# Altium project PCB_STM32_PULT.PrjPcb
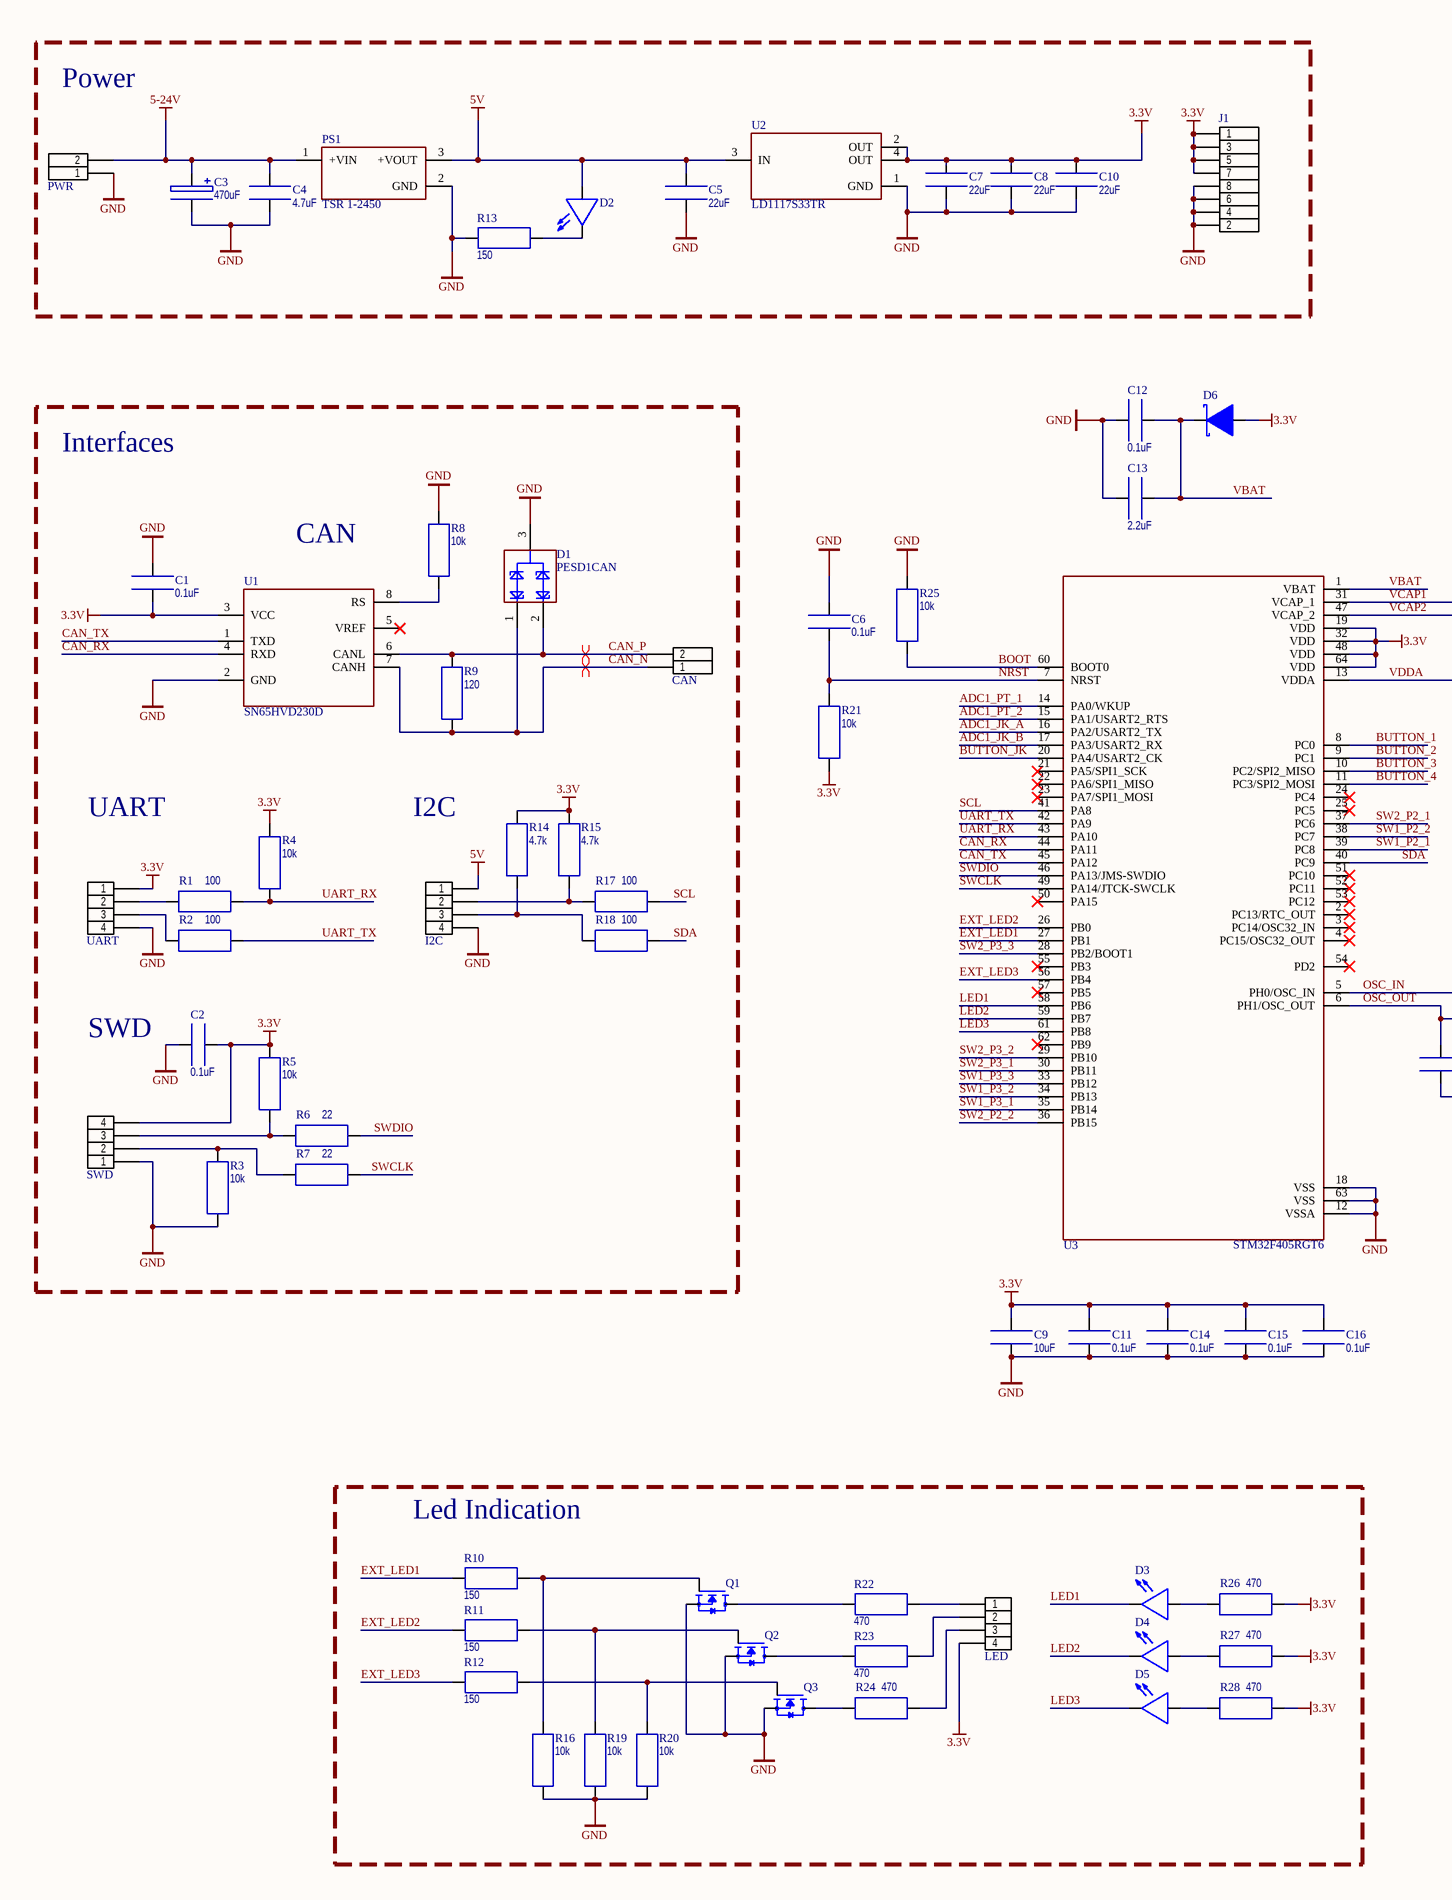
[diagram p0: Sheet1.SchDoc, left]
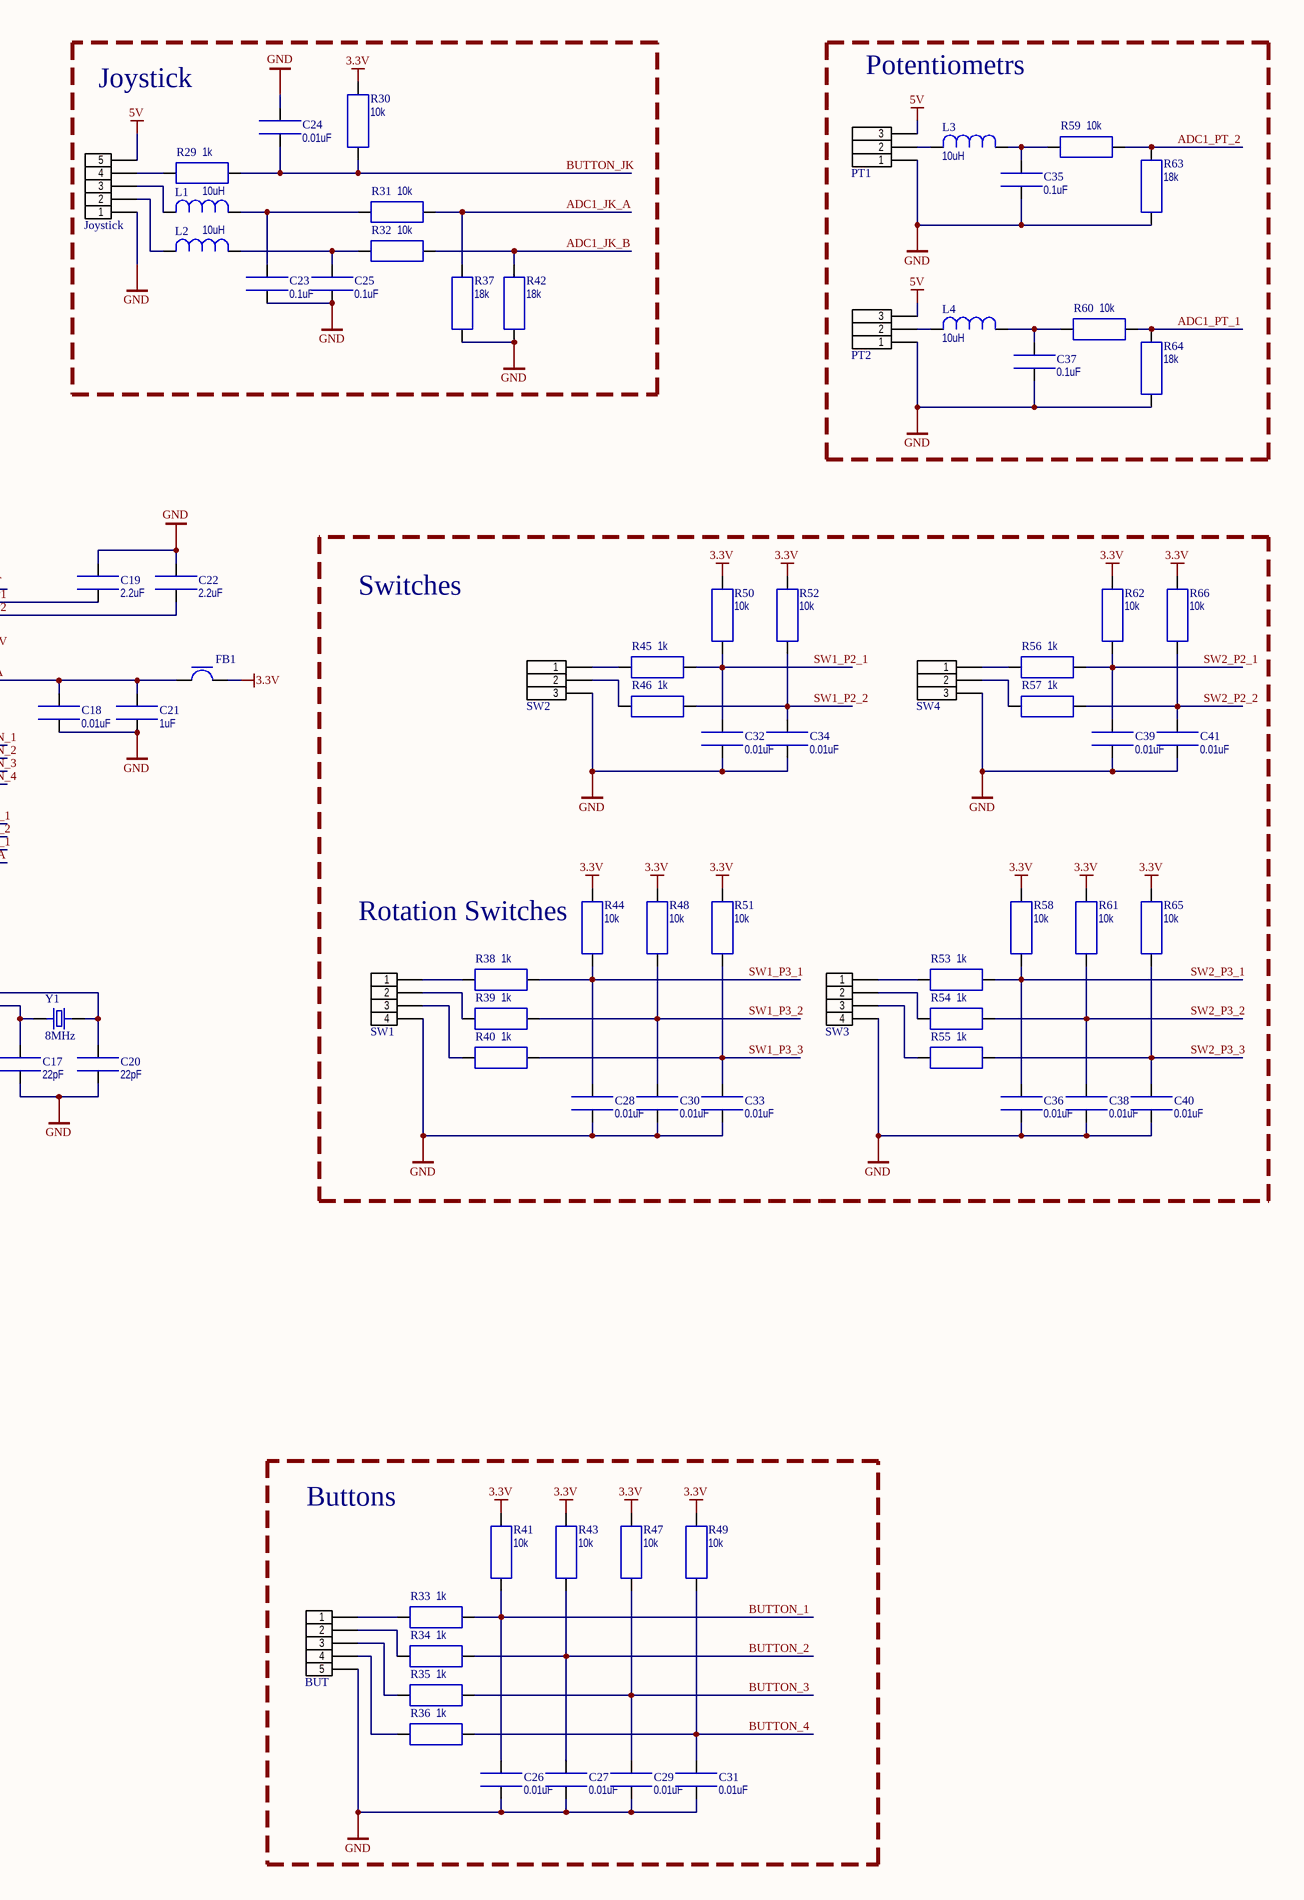
[diagram p1: Sheet1.SchDoc, right]
1 sheet, 141 parts. Net scope: global (net labels, ports and power ports of the same name join across sheets).
Board file: PCB1.PcbDoc

## Sheet Sheet1.SchDoc
size A2; SheetNumber: 1; SheetTotal: 1

### Parts
BUT  B5B-XH-A  [JST_B5B-XH-A]  (value not drawn)
C1  0.1uF  [CAP 0603]
C2  0.1uF  [CAP 0603]
C3  470uF  [ECAP G]
C4  4.7uF  [CAP 0603]
C5  22uF  [CAP 0805]
C6  0.1uF  [CAP 0603]
C7  22uF  [CAP 0805]
C8  22uF  [CAP 0805]
C9  10uF  [CAP 0805]
C10  22uF  [CAP 0805]
C11  0.1uF  [CAP 0603]
C12  0.1uF  [CAP 0603]
C13  2.2uF  [CAP 0603]
C14  0.1uF  [CAP 0603]
C15  0.1uF  [CAP 0603]
C16  0.1uF  [CAP 0603]
C17  22pF  [CAP 0603]
C18  0.01uF  [CAP 0603]
C19  2.2uF  [CAP 0603]
C20  22pF  [CAP 0603]
C21  1uF  [CAP 0603]
C22  2.2uF  [CAP 0603]
C23  0.1uF  [CAP 0603]
C24  0.01uF  [CAP 0603]
C25  0.1uF  [CAP 0603]
C26  0.01uF  [CAP 0603]
C27  0.01uF  [CAP 0603]
C28  0.01uF  [CAP 0603]
C29  0.01uF  [CAP 0603]
C30  0.01uF  [CAP 0603]
C31  0.01uF  [CAP 0603]
C32  0.01uF  [CAP 0603]
C33  0.01uF  [CAP 0603]
C34  0.01uF  [CAP 0603]
C35  0.1uF  [CAP 0603]
C36  0.01uF  [CAP 0603]
C37  0.1uF  [CAP 0603]
C38  0.01uF  [CAP 0603]
C39  0.01uF  [CAP 0603]
C40  0.01uF  [CAP 0603]
C41  0.01uF  [CAP 0603]
CAN  B2B-XH-A  [JST_B2B-XH-A]  (value not drawn)
D1  PESD1CAN  [SOT23-3]
D2  LED 0603  [LED 0603]  (value not drawn)
D3  LED 0603  [LED 0603]  (value not drawn)
D4  LED 0603  [LED 0603]  (value not drawn)
D5  LED 0603  [LED 0603]  (value not drawn)
D6  SM5819PL  [SOD-123FL]  (value not drawn)
FB1  Ferrite bead 0603  [Ferrite bead 0603]  (value not drawn)
I2C  B4B-XH-A  [JST_B4B-XH-A]  (value not drawn)
J1  Pin Header 2x4  [Pin Header 2x4]  (value not drawn)
Joystick  B5B-XH-A  [JST_B5B-XH-A]  (value not drawn)
L1  10uH  [L 0603]
L2  10uH  [L 0603]
L3  10uH  [L 0603]
L4  10uH  [L 0603]
LED  B4B-XH-A  [JST_B4B-XH-A]  (value not drawn)
PS1  TSR 1-2450  [SIP3]
PT1  B3B-XH-A  [JST_B3B-XH-A]  (value not drawn)
PT2  B3B-XH-A  [JST_B3B-XH-A]  (value not drawn)
PWR  B2B-XH-A  [JST_B2B-XH-A]  (value not drawn)
Q1  MMFTN20  [SOT23-3]  (value not drawn)
Q2  MMFTN20  [SOT23-3]  (value not drawn)
Q3  MMFTN20  [SOT23-3]  (value not drawn)
R1  100  [RES 0603]
R2  100  [RES 0603]
R3  10k  [RES 0603]
R4  10k  [RES 0603]
R5  10k  [RES 0603]
R6  22  [RES 0603]
R7  22  [RES 0603]
R8  10k  [RES 0603]
R9  120  [RES 0603]
R10  150  [RES 0603]
R11  150  [RES 0603]
R12  150  [RES 0603]
R13  150  [RES 0603]
R14  4.7k  [RES 0603]
R15  4.7k  [RES 0603]
R16  10k  [RES 0603]
R17  100  [RES 0603]
R18  100  [RES 0603]
R19  10k  [RES 0603]
R20  10k  [RES 0603]
R21  10k  [RES 0603]
R22  470  [RES 0603]
R23  470  [RES 0603]
R24  470  [RES 0603]
R25  10k  [RES 0603]
R26  470  [RES 0603]
R27  470  [RES 0603]
R28  470  [RES 0603]
R29  1k  [RES 0603]
R30  10k  [RES 0603]
R31  10k  [RES 0603]
R32  10k  [RES 0603]
R33  1k  [RES 0603]
R34  1k  [RES 0603]
R35  1k  [RES 0603]
R36  1k  [RES 0603]
R37  18k  [RES 0603]
R38  1k  [RES 0603]
R39  1k  [RES 0603]
R40  1k  [RES 0603]
R41  10k  [RES 0603]
R42  18k  [RES 0603]
R43  10k  [RES 0603]
R44  10k  [RES 0603]
R45  1k  [RES 0603]
R46  1k  [RES 0603]
R47  10k  [RES 0603]
R48  10k  [RES 0603]
R49  10k  [RES 0603]
R50  10k  [RES 0603]
R51  10k  [RES 0603]
R52  10k  [RES 0603]
R53  1k  [RES 0603]
R54  1k  [RES 0603]
R55  1k  [RES 0603]
R56  1k  [RES 0603]
R57  1k  [RES 0603]
R58  10k  [RES 0603]
R59  10k  [RES 0603]
R60  10k  [RES 0603]
R61  10k  [RES 0603]
R62  10k  [RES 0603]
R63  18k  [RES 0603]
R64  18k  [RES 0603]
R65  10k  [RES 0603]
R66  10k  [RES 0603]
SW1  B4B-XH-A  [JST_B4B-XH-A]  (value not drawn)
SW2  B3B-XH-A  [JST_B3B-XH-A]  (value not drawn)
SW3  B4B-XH-A  [JST_B4B-XH-A]  (value not drawn)
SW4  B3B-XH-A  [JST_B3B-XH-A]  (value not drawn)
SWD  B4B-XH-A  [JST_B4B-XH-A]  (value not drawn)
U1  SN65HVD230D  [SOIC8]
U2  LD1117S33TR  [SOT223]
U3  STM32F405RGT6  [LQFP64]
UART  B4B-XH-A  [JST_B4B-XH-A]  (value not drawn)
Y1  8MHz  [HC-49S]

### Blocks framed on the sheet
Power: C3-C5 C7 C8 C10 D2 J1 PS1 PWR R13 U2
Joystick: C23-C25 Joystick L1 L2 R29-R32 R37 R42
Potentiometrs: C35 C37 L3 L4 PT1 PT2 R59 R60 R63 R64
Led Indication: D3-D5 LED Q1-Q3 R10-R12 R16 R19 R20 R22-R24 R26-R28
Buttons: BUT C26 C27 C29 C31 R33-R36 R41 R43 R47 R49

### Nets
3.3V: C1.1 C2.2 C7.2 C8.2 C9.1 C10.2 C11.1 C14.1 C15.1 C16.1 D6.1 FB1.2 J1.1 J1.3 J1.5 J1.7 LED.4 R4.2 R5.2 R14.2 R15.2 R21.1 R26.2 R27.2 R28.2 R30.2 R41.2 R43.2 R44.2 R47.2 R48.2 R49.2 R50.2 R51.2 R52.2 R58.2 R61.2 R62.2 R65.2 R66.2 SWD.4 U1.3(VCC) U2.2(OUT) U2.4(OUT) U3.19(VDD) U3.32(VDD) U3.48(VDD) U3.64(VDD) UART.1
5-24V: C3.1 C4.2 PS1.1(+VIN) PWR.2
5V: C5.2 D2.1 I2C.1 Joystick.5 PS1.3(+VOUT) PT1.3 PT2.3 U2.3(IN)
GND: BUT.5 C1.2 C2.1 C3.2 C4.1 C5.1 C6.2 C7.1 C8.1 C9.2 C10.1 C11.2 C12.1 C13.2 C14.2 C15.2 C16.2 C17.1 C18.1 C19.2 C20.1 C21.1 C22.2 C23.1 C24.2 C25.1 C26.1 C27.1 C28.1 C29.1 C30.1 C31.1 C32.1 C33.1 C34.1 C35.1 C36.1 C37.1 C38.1 C39.1 C40.1 C41.1 D1.3 I2C.4 J1.2 J1.4 J1.6 J1.8 Joystick.1 PS1.2(GND) PT1.1 PT2.1 PWR.1 Q1.2(S) Q2.2(S) Q3.2(S) R3.1 R8.2 R13.1 R16.1 R19.1 R20.1 R25.2 R37.1 R42.1 R63.1 R64.1 SW1.4 SW2.3 SW3.4 SW4.3 SWD.1 U1.2(GND) U2.1(GND) U3.12(VSSA) U3.18(VSS) U3.63(VSS) UART.4
ADC1_JK_A: R31.2 R37.2 U3.16(PA2/USART2_TX)
ADC1_JK_B: R32.2 R42.2 U3.17(PA3/USART2_RX)
ADC1_PT_1: R60.2 R64.2 U3.14(PA0/WKUP)
ADC1_PT_2: R59.2 R63.2 U3.15(PA1/USART2_RTS)
BOOT: R25.1 U3.60(BOOT0)
BUTTON_1: C26.2 R33.2 R41.1 U3.8(PC0)
BUTTON_2: C27.2 R34.2 R43.1 U3.9(PC1)
BUTTON_3: C29.2 R35.2 R47.1 U3.10(PC2/SPI2_MISO)
BUTTON_4: C31.2 R36.2 R49.1 U3.11(PC3/SPI2_MOSI)
BUTTON_JK: C24.1 R29.2 R30.1 U3.20(PA4/USART2_CK)
CAN_N: CAN.1 D1.1 R9.1 U1.7(CANH)
CAN_P: CAN.2 D1.2 R9.2 U1.6(CANL)
CAN_RX: U1.4(RXD) U3.44(PA11)
CAN_TX: U1.1(TXD) U3.45(PA12)
EXT_LED1: R10.2 U3.27(PB1)
EXT_LED2: R11.2 U3.26(PB0)
EXT_LED3: R12.2 U3.56(PB4)
LED1: D3.2 U3.58(PB6)
LED2: D4.2 U3.59(PB7)
LED3: D5.2 U3.61(PB8)
NRST: C6.1 R21.2 U3.7(NRST)
OSC_IN: C20.2 U3.5(PH0/OSC_IN) Y1.2
OSC_OUT: C17.2 U3.6(PH1/OSC_OUT) Y1.1
SCL: R17.2 U3.41(PA8)
SDA: R18.2 U3.40(PC9)
SW1_P2_1: C32.2 R45.2 R50.1 U3.39(PC8)
SW1_P2_2: C34.2 R46.2 R52.1 U3.38(PC7)
SW1_P3_1: C28.2 R38.2 R44.1 U3.35(PB14)
SW1_P3_2: C30.2 R39.2 R48.1 U3.34(PB13)
SW1_P3_3: C33.2 R40.2 R51.1 U3.33(PB12)
SW2_P2_1: C39.2 R56.2 R62.1 U3.37(PC6)
SW2_P2_2: C41.2 R57.2 R66.1 U3.36(PB15)
SW2_P3_1: C36.2 R53.2 R58.1 U3.30(PB11)
SW2_P3_2: C38.2 R54.2 R61.1 U3.29(PB10)
SW2_P3_3: C40.2 R55.2 R65.1 U3.28(PB2/BOOT1)
SWCLK: R7.2 U3.49(PA14/JTCK-SWCLK)
SWDIO: R6.2 U3.46(PA13/JMS-SWDIO)
UART_RX: R1.2 R4.1 U3.43(PA10)
UART_TX: R2.2 U3.42(PA9)
VBAT: C12.2 C13.1 D6.2 U3.1(VBAT)
VCAP1: C19.1 U3.31(VCAP_1)
VCAP2: C22.1 U3.47(VCAP_2)
VDDA: C18.2 C21.2 FB1.1 U3.13(VDDA)
NetBUT_1: BUT.1 R33.1
NetBUT_2: BUT.2 R34.1
NetBUT_3: BUT.3 R35.1
NetBUT_4: BUT.4 R36.1
NetC23_2: C23.2 L1.2 R31.1
NetC25_2: C25.2 L2.2 R32.1
NetC35_2: C35.2 L3.2 R59.1
NetC37_2: C37.2 L4.2 R60.1
NetD2_2: D2.2 R13.2
NetD3_1: D3.1 R26.1
NetD4_1: D4.1 R27.1
NetD5_1: D5.1 R28.1
NetI2C_2: I2C.2 R15.1 R17.1
NetI2C_3: I2C.3 R14.1 R18.1
NetJoystick_2: Joystick.2 L2.1
NetJoystick_3: Joystick.3 L1.1
NetJoystick_4: Joystick.4 R29.1
NetL3_1: L3.1 PT1.2
NetL4_1: L4.1 PT2.2
NetLED_1: LED.1 R22.1
NetLED_2: LED.2 R23.1
NetLED_3: LED.3 R24.2
NetQ1_1: Q1.1(G) R10.1 R16.2
NetQ1_3: Q1.3(D) R22.2
NetQ2_1: Q2.1(G) R11.1 R19.2
NetQ2_3: Q2.3(D) R23.2
NetQ3_1: Q3.1(G) R12.1 R20.2
NetQ3_3: Q3.3(D) R24.1
NetR1_1: R1.1 UART.2
NetR2_1: R2.1 UART.3
NetR3_2: R3.2 R7.1 SWD.2
NetR5_1: R5.1 R6.1 SWD.3
NetR8_1: R8.1 U1.8(RS)
NetR38_1: R38.1 SW1.1
NetR39_1: R39.1 SW1.2
NetR40_1: R40.1 SW1.3
NetR45_1: R45.1 SW2.1
NetR46_1: R46.1 SW2.2
NetR53_1: R53.1 SW3.1
NetR54_1: R54.1 SW3.2
NetR55_1: R55.1 SW3.3
NetR56_1: R56.1 SW4.1
NetR57_1: R57.1 SW4.2

Not connected (* = marked no-connect by the designer): U1 5(VREF)*; U3 2(PC13/RTC_OUT)* 3(PC14/OSC32_IN)* 4(PC15/OSC32_OUT)* 21(PA5/SPI1_SCK)* 22(PA6/SPI1_MISO)* 23(PA7/SPI1_MOSI)* 24(PC4)* 25(PC5)* 50(PA15)* 51(PC10)* 52(PC11)* 53(PC12)* 54(PD2)* 55(PB3)* 57(PB5)* 62(PB9)*

### Layout directives
differential pair: CAN_N, CAN_P

### Notes on the sheet
- Interfaces
- (near U1) CAN
- Switches
- UART
- I2C
- (near R44) Rotation Switches
- SWD

### Library data of the parts
BUT Joystick = B5B-XH-A: Connector Header Through Hole 5 position 0.098 (2.50mm); MF: JST Sales; SnapEDA_Link: https://www.snapeda.com/parts/B5B-XH-A/JST+Sales+America+Inc./view-part/?ref=snap; Package: None; Value: *; MP: B5B-XH-A; Check_prices: https://www.snapeda.com/parts/B5B-XH-A/JST+Sales+America+Inc./view-part/?ref=eda
C1 C2 C4 C6 C11-C41 = CAP 0603
  C1 C2 C6 C11 C12 C14-C16 C23 C25 C35 C37: Value: 0.1uF
  C4: Value: 4.7uF
  C13 C19 C22: Value: 2.2uF
  C17 C20: Value: 22pF
  C18 C24 C26-C34 C36 C38-C41: Value: 0.01uF
  C21: Value: 1uF
C3 = ECAP: Value: 470uF
C5 C7-C10 = CAP 0805
  C5 C7 C8 C10: Value: 22uF
  C9: Value: 10uF
CAN PWR = B2B-XH-A: Connector Header Through Hole 2 position 0.098 (2.50mm); MF: JST Sales; MP: B2B-XH-A(LF)(SN); SnapEDA_Link: https://www.snapeda.com/parts/B2B-XH-A(LF)(SN)/JST/view-part/?ref=snap; Package: None; Value: *; Check_prices: https://www.snapeda.com/parts/B2B-XH-A(LF)(SN)/JST/view-part/?ref=eda
D1 = PESD1CAN: 50V Clamp 3A (8/20Âµs) Ipp Tvs Diode Surface Mount SOT-323; MF: Nexperia USA; SnapEDA_Link: https://www.snapeda.com/parts/PESD1CAN/Nexperia/view-part/?ref=snap; Package: SOT-23-3 NXP Semiconductors; Value: *; MP: PESD1CAN; Check_prices: https://www.snapeda.com/parts/PESD1CAN/Nexperia/view-part/?ref=eda
D2-D5 = LED 0603: Green 560nm LED Indication - Discrete 2.2V 0603 (1608 Metric); MF: Rohm; MP: SML-D12P8WT86; SnapEDA_Link: https://www.snapeda.com/parts/SML-D12P8WT86/Rohm/view-part/?ref=snap; Package: 0603 Rohm; Value: *; Check_prices: https://www.snapeda.com/parts/SML-D12P8WT86/Rohm/view-part/?ref=eda
D6 = SM5819PL: Schottky Diode, 40V, 1A
I2C LED SW1 SW3 SWD UART = B4B-XH-A: Connector Header Through Hole 4 position 0.098 (2.50mm); MF: JST Sales; SnapEDA_Link: https://www.snapeda.com/parts/B4B-XH-A/JST/view-part/?ref=snap; Package: None; Value: *; MP: B4B-XH-A; Check_prices: https://www.snapeda.com/parts/B4B-XH-A/JST/view-part/?ref=eda
J1 = Pin Header 2x4: Connector Header Through Hole 8 position 0.100 (2.54mm); MF: Samtec; MP: MTSW-104-07-T-D-240-LL; SnapEDA_Link: https://www.snapeda.com/parts/MTSW-104-07-T-D-240-LL/Samtec/view-part/?ref=snap; Package: None; Value: *; Check_prices: https://www.snapeda.com/parts/MTSW-104-07-T-D-240-LL/Samtec/view-part/?ref=eda
L1-L4 = L 0603: Value: 10uH
PS1 = TSR 1-2450: MF: Traco Power; MP: TSR_1-2450; Value: *; Availability: Unavailable; Price: None; Package: None
PT1 PT2 SW2 SW4 = B3B-XH-A: Connector Header Through Hole 3 position 0.098 (2.50mm); MF: JST Sales; SnapEDA_Link: https://www.snapeda.com/parts/B3B-XH-A/JST+Sales+America+Inc./view-part/?ref=snap; Package: None; Value: *; MP: B3B-XH-A; Check_prices: https://www.snapeda.com/parts/B3B-XH-A/JST+Sales+America+Inc./view-part/?ref=eda
Q1-Q3 = MMFTN20: MOSFET, SOT-23, N, 50V, 0.1A, 15â„¦, 150Â°C; MF: Diotec Semiconductor; SnapEDA_Link: https://www.snapeda.com/parts/MMFTN20/Diotec/view-part/?ref=snap; Package: SOT-23 Diotec; Value: *; MP: MMFTN20; Check_prices: https://www.snapeda.com/parts/MMFTN20/Diotec/view-part/?ref=eda
R1-R66 = RES 0603
  R1 R2 R17 R18: Value: 100
  R3-R5 R8 R16 R19-R21 R25 R30-R32 R41 R43 R44 R47-R52 R58-R62 R65 R66: Value: 10k
  R6 R7: Value: 22
  R9: Value: 120
  R10-R13: Value: 150
  R14 R15: Value: 4.7k
  R22-R24 R26-R28: Value: 470
  R29 R33-R36 R38-R40 R45 R46 R53-R57: Value: 1k
  R37 R42 R63 R64: Value: 18k
U1 = SN65HVD230D: TI, 1/1 Transceiver Half CANbus 8-SO(); Part: SN65HVD230D
U2 = LD1117S33TR: Linear Voltage Regulator IC Positive Fixed 1 Output 800mA SOT-223; MF: STMicroelectronics; Value: *; SnapEDA_Link: https://www.snapeda.com/parts/LD1117S33TR/STMicroelectronics/view-part/?ref=snap; MP: LD1117S33TR; Purchase-URL: https://pricing.snapeda.com/search/part/LD1117S33TR/?ref=eda; Check_prices: https://www.snapeda.com/parts/LD1117S33TR/STMicroelectronics/view-part/?ref=eda; Availability: In Stock; Price: None; Package: TO-261-4 STMicroelectronics
U3 = STM32F405RGT6: ARM CortexA-M4 STM32F4 Microcontroller IC 32-Bit Single-Core 168MHz 1MB (1M x 8) FLASH 64-LQFP (10x10); MF: STMicroelectronics; SnapEDA_Link: https://www.snapeda.com/parts/STM32F405RGT6/STMicroelectronics/view-part/?ref=snap; Package: LQFP-64 STMicroelectronics; Value: *; MP: STM32F405RGT6; Check_prices: https://www.snapeda.com/parts/STM32F405RGT6/STMicroelectronics/view-part/?ref=eda
Y1 = SJK-6B-8.000-16-30-50-C-50-H: Crystals 8MHz HC49S; MF: ECS International; MP: ECS-17.1776-20-4; SnapEDA_Link: https://www.snapeda.com/parts/ECS-17.1776-20-4/ECS/view-part/?ref=snap; Package: HC-49US ECS Inc.; Value: *; Check_prices: https://www.snapeda.com/parts/ECS-17.1776-20-4/ECS/view-part/?ref=eda